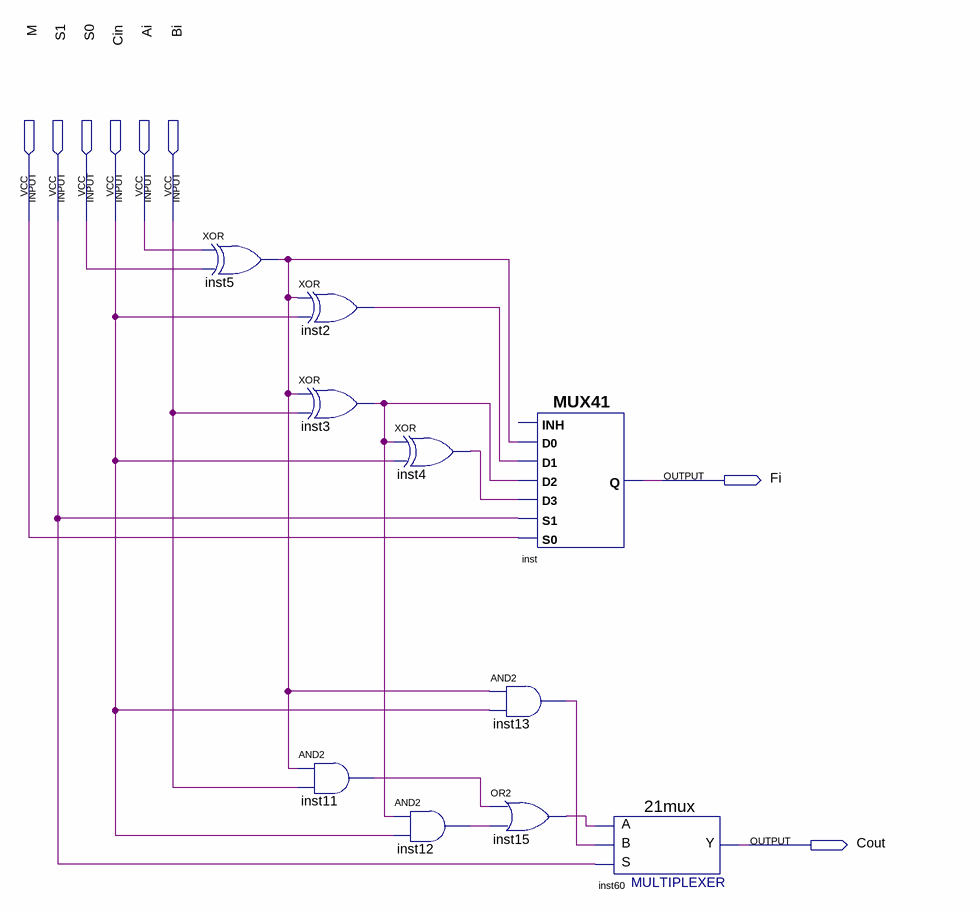
[diagram p0: schematic sheet]
// Quartus schematic q53.bdf as structural Verilog: 10 symbols, 8 pins
module q53 (
  input  M,
  input  S1,
  input  S0,
  input  Cin,
  input  Ai,
  input  Bi,
  output Fi,
  output Cout
);

  wire inst2_out, inst3_out, inst4_out, inst5_out, inst11_out, inst12_out, inst13_out, inst15_out;

  xor inst5 (inst5_out, Ai, S0);
  xor inst2 (inst2_out, inst5_out, Cin);
  xor inst3 (inst3_out, inst5_out, Bi);
  and inst11 (inst11_out, inst5_out, Bi);
  xor inst4 (inst4_out, inst3_out, Cin);
  and inst12 (inst12_out, inst3_out, Cin);
  MUX41 inst (.S0(M), .D2(inst3_out), .S1(S1), .D3(inst4_out), .D0(inst5_out), .D1(inst2_out), .Q(Fi));  // open: INH
  and inst13 (inst13_out, inst5_out, Cin);
  or inst15 (inst15_out, inst11_out, inst12_out);
  \21mux  inst60 (.S(S1), .B(inst13_out), .A(inst15_out), .Y(Cout));
endmodule
